# EAGLE design BS170 (EAGLE 6.4)
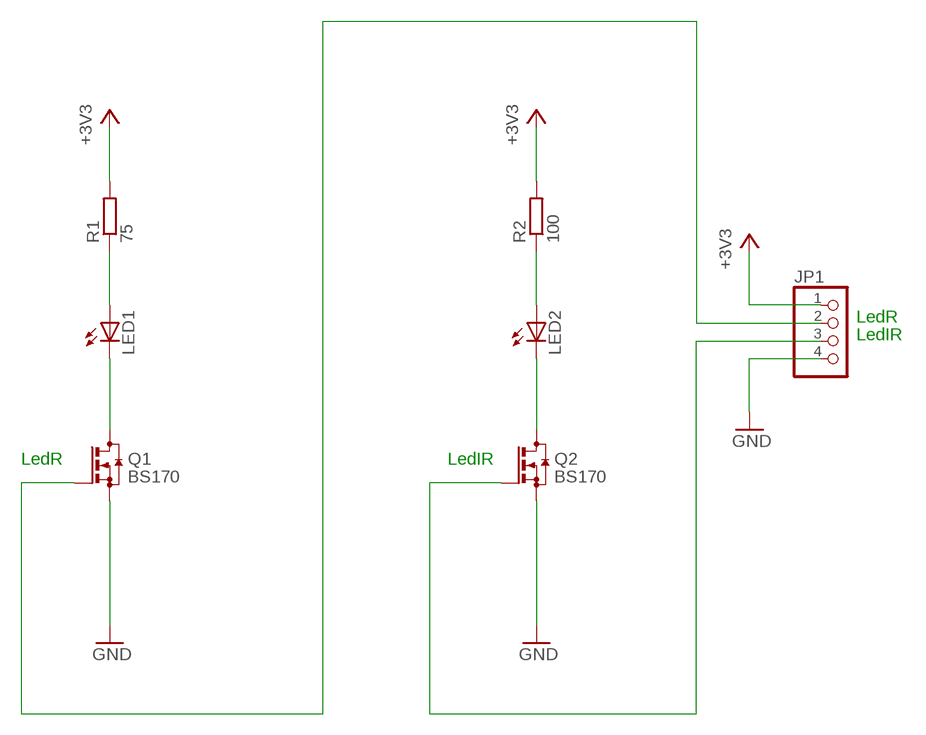
[diagram p0: schematic, sheet 1]

## Parts
JP1  PINHD-1X4  [1X04]
LED1  LED5MM  [LED5MM]
LED2  LED5MM  [LED5MM]
Q1  BS170  BSS123  [SOT23]
Q2  BS170  BSS123  [SOT23]
R1  75  R-EU_0207/10  [0207/10]
R2  100  R-EU_0207/10  [0207/10]

## Nets
+3V3: JP1.1 R1.2 R2.2
GND: JP1.4 Q1.2(S) Q2.2(S)
N$1: LED1.A R1.1
N$2: LED1.K(C) Q1.3(D)
N$3: LED2.A R2.1
N$4: LED2.K(C) Q2.3(D)
N$5: JP1.3 Q2.1(G)
N$7: JP1.2 Q1.1(G)

## Notes on the sheet
- LedR
- LedIR
- LedR | LedIR

## Library data of the parts
JP1 = pinhead:PINHD-1X4: PIN HEADER
LED1 LED2 = led:LED: LED OSRAM: - CHIPLED LG R971, LG N971, LY N971, LG Q971, LY Q971, LO R971, LY R971 LH N974, LH R974 LS Q976, LO Q976, LY Q976 LO Q996 - Hyper CHIPLED LW Q18S LB Q993, LB Q99A, LB R99A - SideLED LS A670, LO A670, LY A670, LG A670, LP A670 LB A673, LV A673, LT A673, LW A673 LH A674 LY A675 LS A676, LA A676, LO A676, LY A676, LW A676 LS A679, LY A679, LG A679 - Hyper Micro SIDELED® LS Y876, LA Y876, LO Y876, LY Y876 LT Y87S - SmartLED LW L88C, LW L88S LB L89C, LB L89S, LG L890 LS L89K, LO L89K, LY L89K LS L896, LA L896, LO L896, LY L896 - TOPLED LS T670, LO T670, LY T670, LG T670, LP T670 LSG T670, LSP T670, LSY T670, LOP T670, LYG T670 LG T671, LOG T671, LSG T671 LB T673, LV T673, LT T673, LW T673 LH T674 LS T676, LA T676, LO T676, LY T676, LB T676, LH T676, LSB T676, LW T676 LB T67C, LV T67C, LT T67C, LS T67K, LO T67K, LY T67K, LW E67C LS E67B, LA E67B, LO E67B, LY E67B, LB E67C, LV E67C, LT E67C LW T67C LS T679, LY T679, LG T679 LS T770, LO T770, LY T770, LG T770, LP T770 LB T773, LV T773, LT T773, LW T773 LH T774 LS E675, LA E675, LY E675, LS T675 LS T776, LA T776, LO T776, LY T776, LB T776 LHGB T686 LT T68C, LB T68C - Hyper Mini TOPLED® LB M676 - Mini TOPLED Santana® LG M470 LS M47K, LO M47K, LY M47K Source: http://www.osram.convergy.de - LUMILED® LXK2-PW12-R00, LXK2-PW12-S00, LXK2-PW14-U00, LXK2-PW14-V00 LXK2-PM12-R00, LXK2-PM12-S00, LXK2-PM14-U00 LXK2-PE12-Q00, LXK2-PE12-R00, LXK2-PE12-S00, LXK2-PE14-T00, LXK2-PE14-U00 LXK2-PB12-K00, LXK2-PB12-L00, LXK2-PB12-M00, LXK2-PB14-N00, LXK2-PB14-P00, LXK2-PB14-Q00 LXK2-PR12-L00, LXK2-PR12-M00, LXK2-PR14-Q00, LXK2-PR14-R00 LXK2-PD12-Q00, LXK2-PD12-R00, LXK2-PD12-S00 LXK2-PH12-R00, LXK2-PH12-S00 LXK2-PL12-P00, LXK2-PL12-Q00, LXK2-PL12-R00 Source: www.luxeon.com
Q1 Q2 = transistor-small-signal:BSS123: N-CHANNEL MOS FET
R1 R2 = rcl:R-EU_: RESISTOR, European symbol

## Board
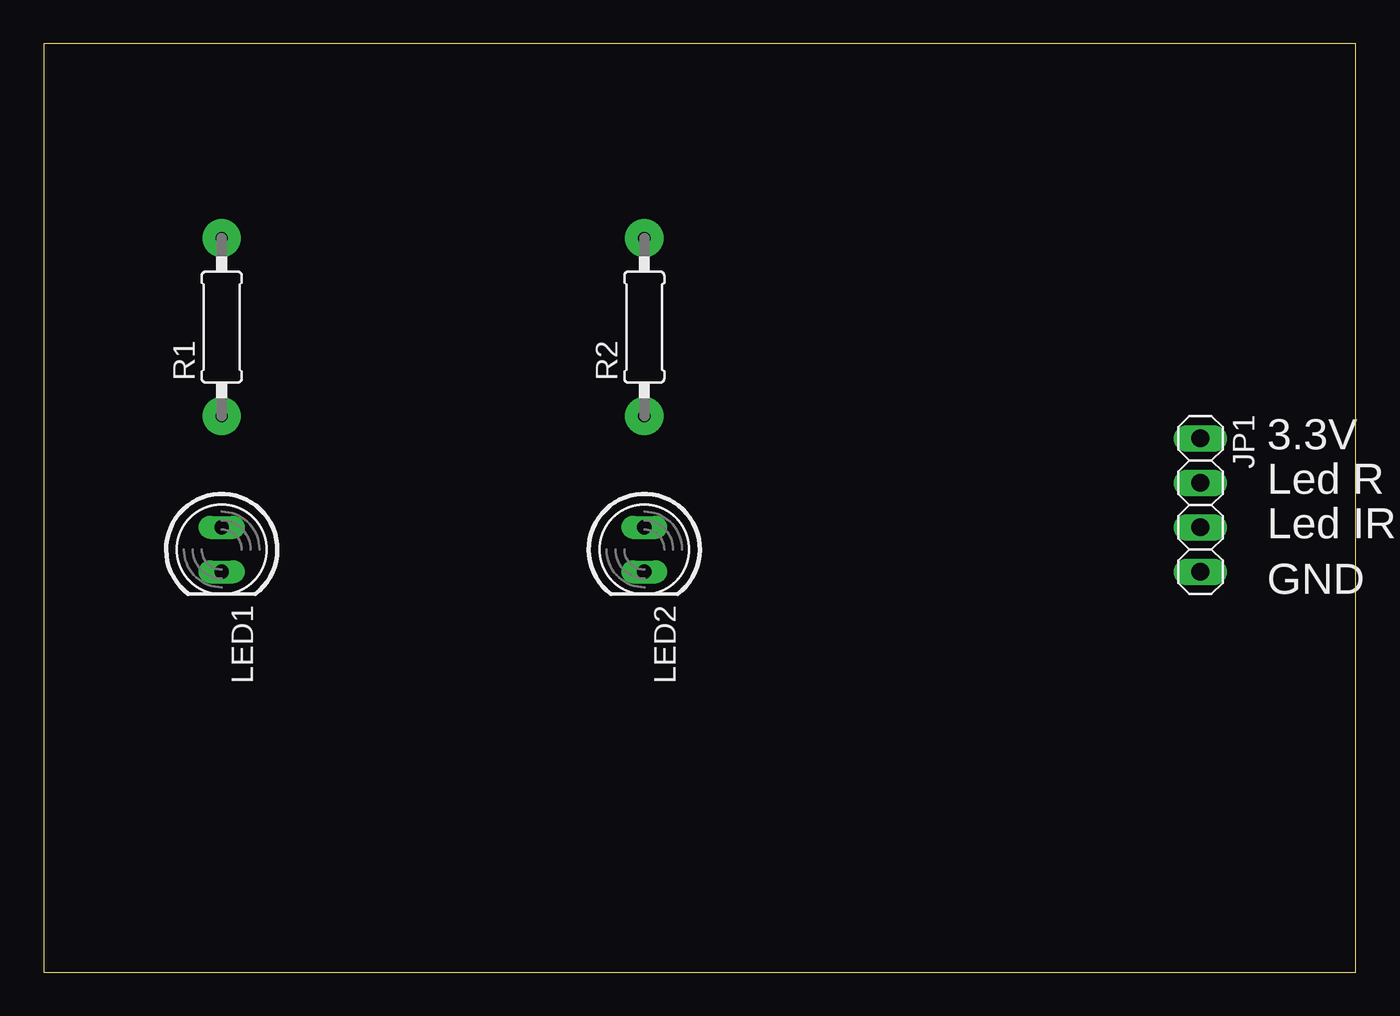
[diagram p1: board, top side]
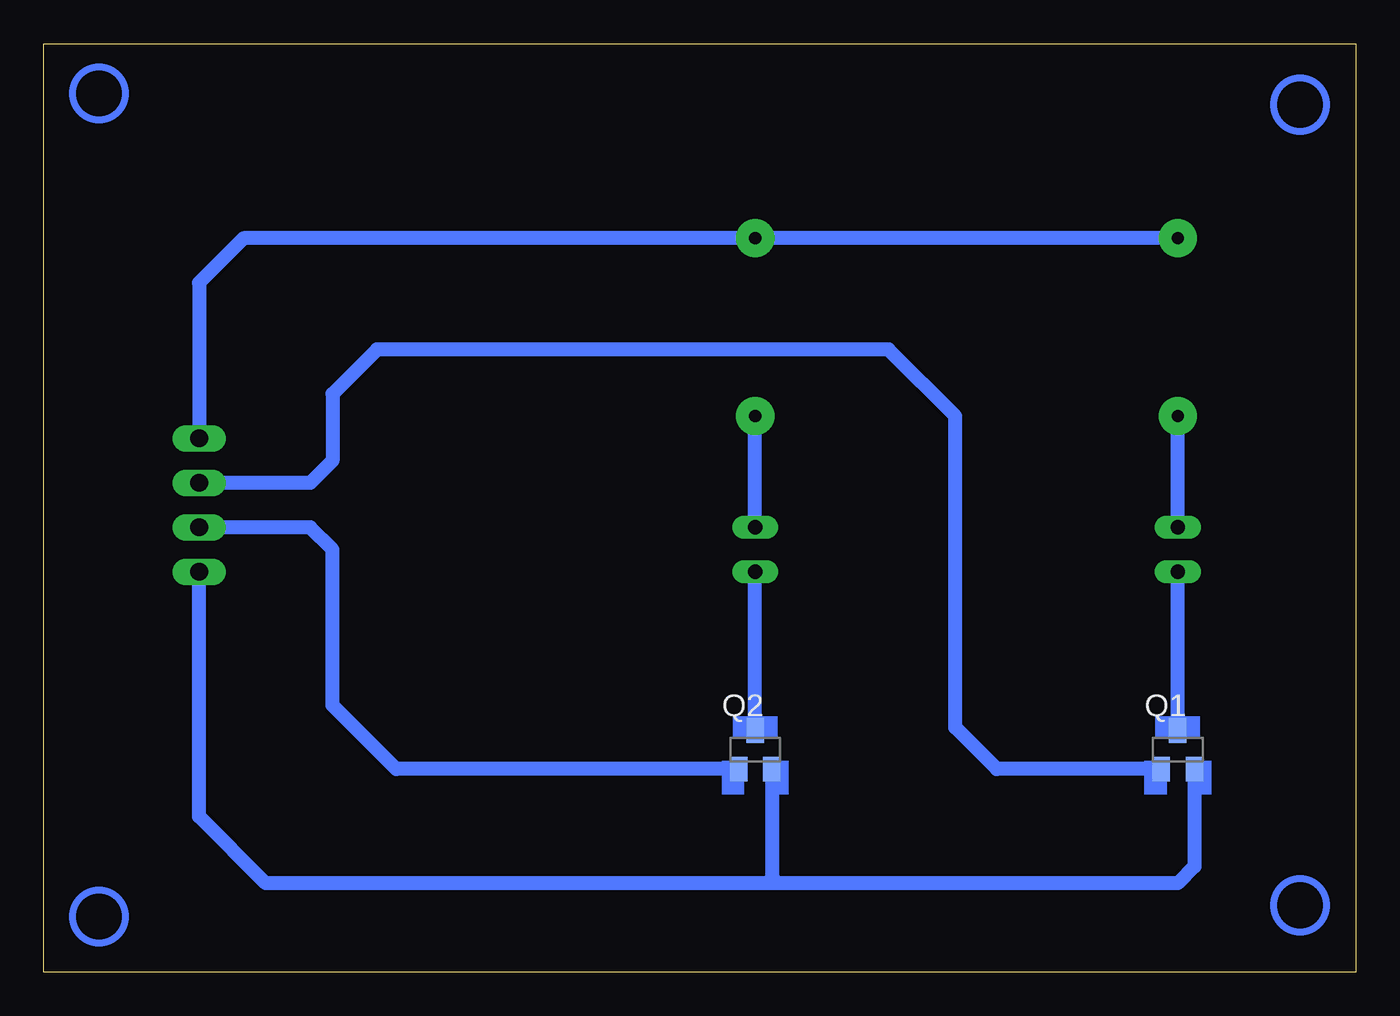
[diagram p2: board, bottom side, seen from below]

Size 74.91 x 53.01 mm. Coordinates in mm from the lower left corner, seen from the top.
Outline: 0,0 74.91,0 74.91,53.01 0,53.01 0,0
Copper layers (1*16): Top 0.035mm / dielectric 1.5mm / Bottom 0.035mm
Design rules "default": minimum track width 10mil, minimum drill 24mil, track to track 8mil, track to pad 8mil, pad to pad 8mil, via to via 8mil, smd to smd 8mil, copper to edge 40mil, drill to drill 8mil, minimum pad ring 10mil, minimum via ring 8mil, stop-mask expansion 4mil, vias tented up to drill 0mil, thermal gap 10mil

### Footprints (pad centres in the part's own frame; a part is rotated, then mirrored left to right if it is on the bottom)
1X04 = drill 1.016 long: 1 -3.81,0; 2 -1.27,0; 3 1.27,0; 4 3.81,0
LED5MM = drill 0.813 long: A -1.27,0; K 1.27,0
SOT23 = smd 1 x 1.4: 1 -0.95,-1.1; 2 0.95,-1.1; 3 0,1.1
0207/10 = drill 0.7 pad 2.184: 1 -5.08,0; 2 5.08,0

### Placement (x,y rotation side)
JP1  66.04,26.67 270 top
LED1  10.16,24.13 270 top
LED2  34.29,24.13 270 top
Q1  10.16,12.7 0 bottom
Q2  34.29,12.7 0 bottom
R1  10.16,36.83 90 top
R2  34.29,36.83 90 top

### Tracks (layer width: path | path; a pad name or v marks a point on that pad's centre or on a via)
+3V3
  Bottom 0.813: R1.2 R2.2 63.5,41.91 66.04,39.37 JP1.1
GND
  Bottom 0.813: Q1.2 9.21,6.03 10.16,5.08 33.02,5.08 | 33.02,5.08 62.23,5.08 66.04,8.89 JP1.4 | Q2.2 33.34,5.4 33.02,5.08
N$1
  Bottom 0.813: LED1.A R1.1
N$2
  Bottom 0.813: Q1.3 LED1.K
N$3
  Bottom 0.813: LED2.A R2.1
N$4
  Bottom 0.813: Q2.3 LED2.K
N$5
  Bottom 0.813: Q2.1 54.78,11.6 58.42,15.24 58.42,24.13 59.69,25.4 JP1.3
N$7
  Bottom 0.813: Q1.1 20.49,11.6 22.86,13.97 22.86,31.75 26.67,35.56 55.88,35.56 58.42,33.02 58.42,29.21 59.69,27.94 JP1.2
(copper drawn outside any net)
  shapes: Bottom area x7, Bottom circle x4

### Text on the board
tPlace: 3.3V | Led R | Led IR | GND